# EAGLE design Solenoid_Driver (EAGLE 7.3.0)
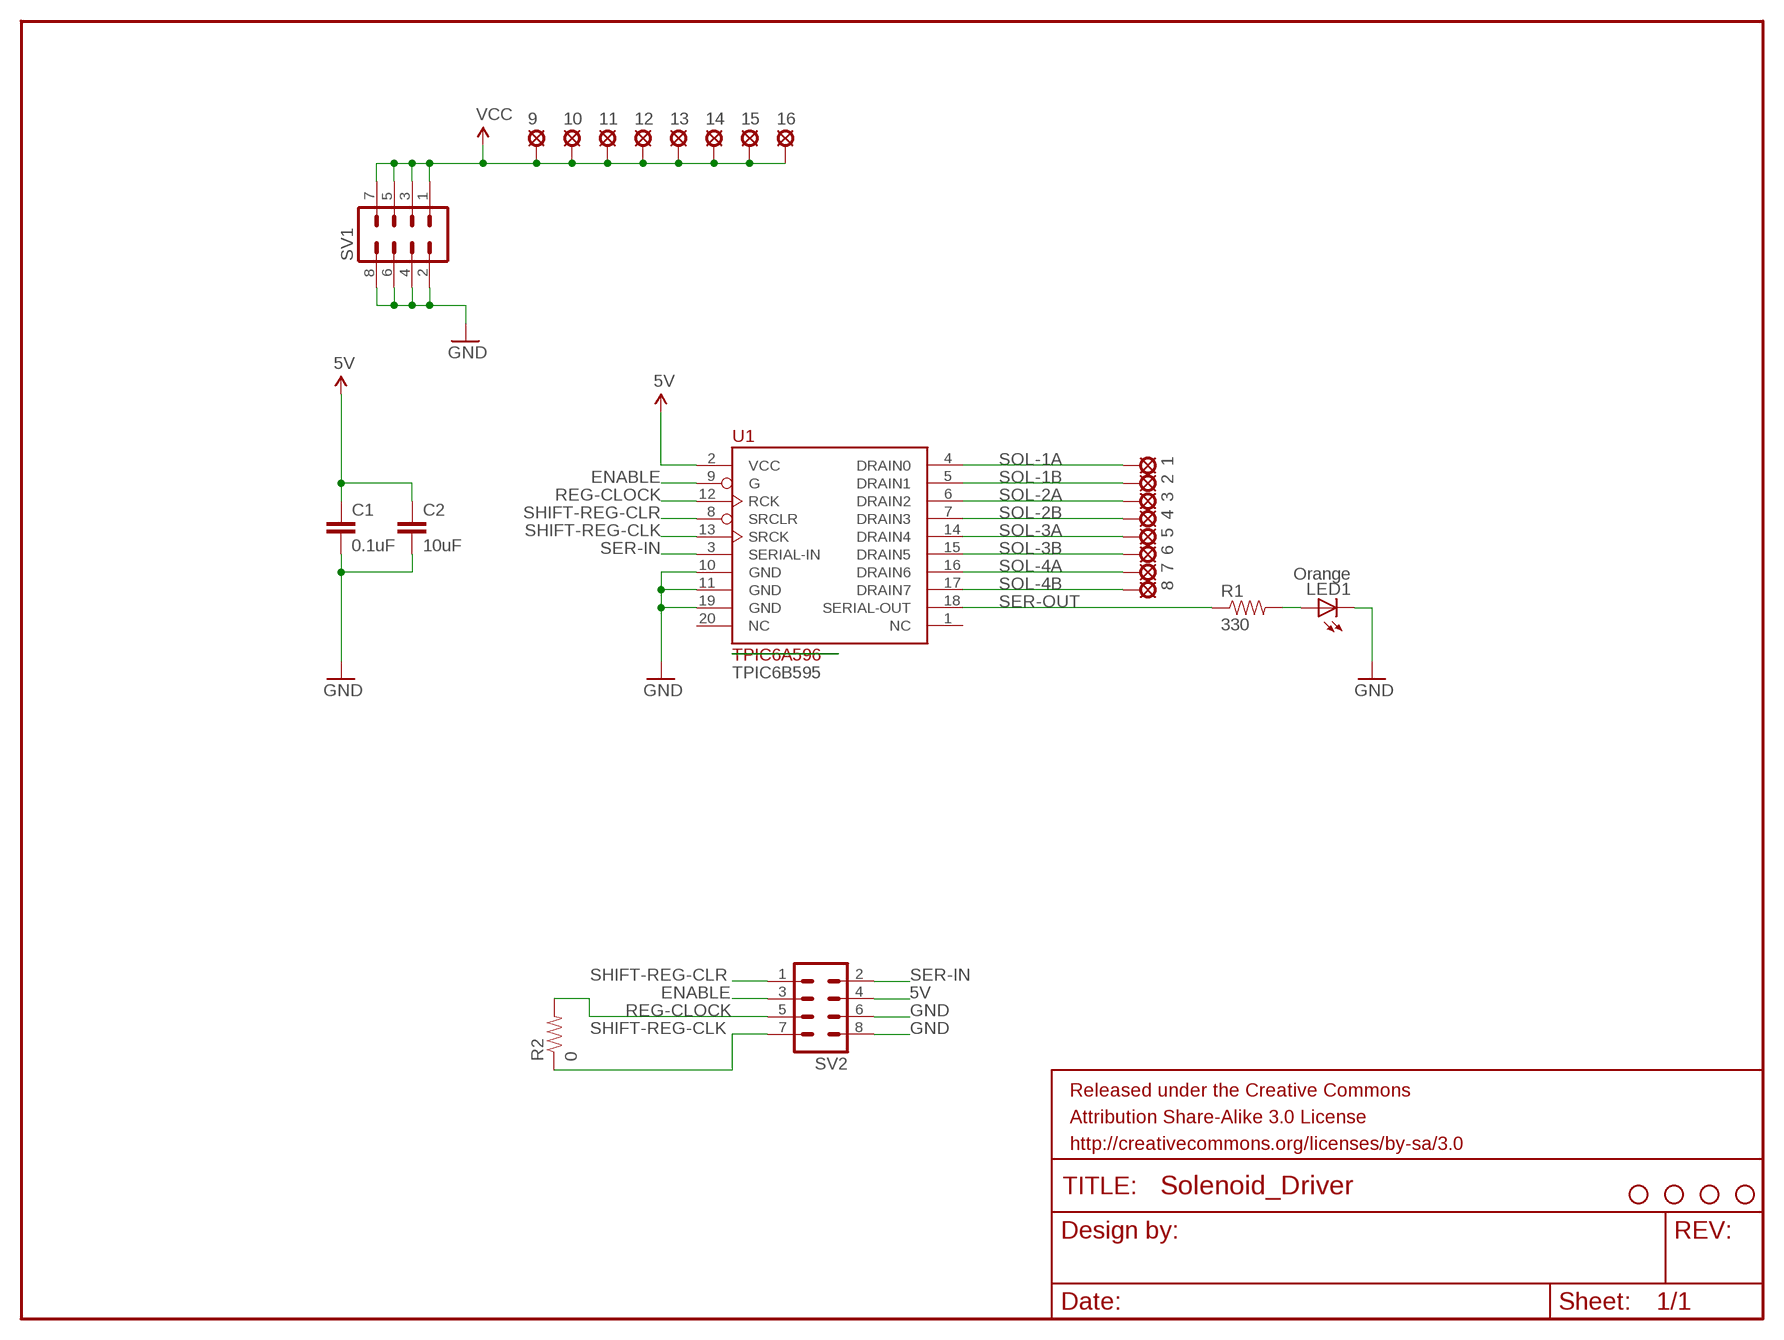
[diagram p0: schematic, sheet 1]

## Parts
1  SE14  [SE14]
2  SE14  [SE14]
3  SE14  [SE14]
4  SE14  [SE14]
5  SE14  [SE14]
6  SE14  [SE14]
7  SE14  [SE14]
8  SE14  [SE14]
9  SE14  [SE14]
10  SE14  [SE14]
11  SE14  [SE14]
12  SE14  [SE14]
13  SE14  [SE14]
14  SE14  [SE14]
15  SE14  [SE14]
16  SE14  [SE14]
C1  0.1uF  CAP0603-CAP  [0603-CAP]
C2  10uF  CAP0603-CAP  [0603-CAP]
JP1  STAND-OFF  [STAND-OFF]
JP2  STAND-OFF  [STAND-OFF]
JP3  STAND-OFF  [STAND-OFF]
JP4  STAND-OFF  [STAND-OFF]
LED1  Orange  LED0603  [LED-0603]
R1  330  RESISTOR0603-RES  [0603-RES]
R2  0  RESISTOR0603-RES  [0603-RES]
SV1  MA04-2  [MA04-2]
SV2  MA04-2  [MA04-2]
U1  TPIC6A596  [SOIC20-W]

## Nets
5V: C1.1 C2.1 SV2.4 U1.2(VCC)
ENABLE: SV2.3 U1.9(G)
GND: C1.2 C2.2 LED1.C SV1.2 SV1.4 SV1.6 SV1.8 SV2.6 SV2.8 U1.10(GND) U1.11(GND) U1.19(GND)
N$1: LED1.A R1.2
REG-CLOCK: R2.2 SV2.5 U1.12(RCK)
SER-IN: SV2.2 U1.3(SERIAL-IN)
SER-OUT: R1.1 U1.18(SERIAL-OUT)
SHIFT-REG-CLK: R2.1 SV2.7 U1.13(SRCK)
SHIFT-REG-CLR: SV2.1 U1.8(SRCLR)
SOL-1A: 1.MP U1.4(DRAIN0)
SOL-1B: 2.MP U1.5(DRAIN1)
SOL-2A: 3.MP U1.6(DRAIN2)
SOL-2B: 4.MP U1.7(DRAIN3)
SOL-3A: 5.MP U1.14(DRAIN4)
SOL-3B: 6.MP U1.15(DRAIN5)
SOL-4A: 7.MP U1.16(DRAIN6)
SOL-4B: 8.MP U1.17(DRAIN7)
VCC: 9.MP 10.MP 11.MP 12.MP 13.MP 14.MP 15.MP 16.MP SV1.1 SV1.3 SV1.5 SV1.7
Unconnected: U1.1(NC) U1.20(NC)

## Notes on the sheet
- TPIC6B595

## Library data of the parts
1-16 = solpad:SE14: SOLDER PAD E1553, drill 1,4mm, distributor Buerklin, 07F820
C1 C2 = SparkFun-Passives:CAP: Capacitor Standard 0603 ceramic capacitor, and 0.1" leaded capacitor.
JP1-JP4 = SparkFun-Electromechanical:STAND-OFF: #4 Stand Off This is the mechanical footprint for a #4 phillips button head screw. Use the keepout ring to avoid running the screw head into surrounding components. SKU : PRT-00447
LED1 = SparkFun-LED:LED: LEDs Standard schematic elements and footprints for 5mm, 3mm, 1206, and 0603 sized LEDs. 5mm - Spark Fun Electronics SKU : COM-00529 (and others)
R1 R2 = SparkFun-Passives:RESISTOR: Resistor Basic schematic elements and footprints for 0603, 1206, and PTH resistors.
SV1 SV2 = con-lstb:MA04-2: PIN HEADER; OC_FARNELL: unknown; OC_NEWARK: unknown
U1 = Personal:TPIC6A596

## Board
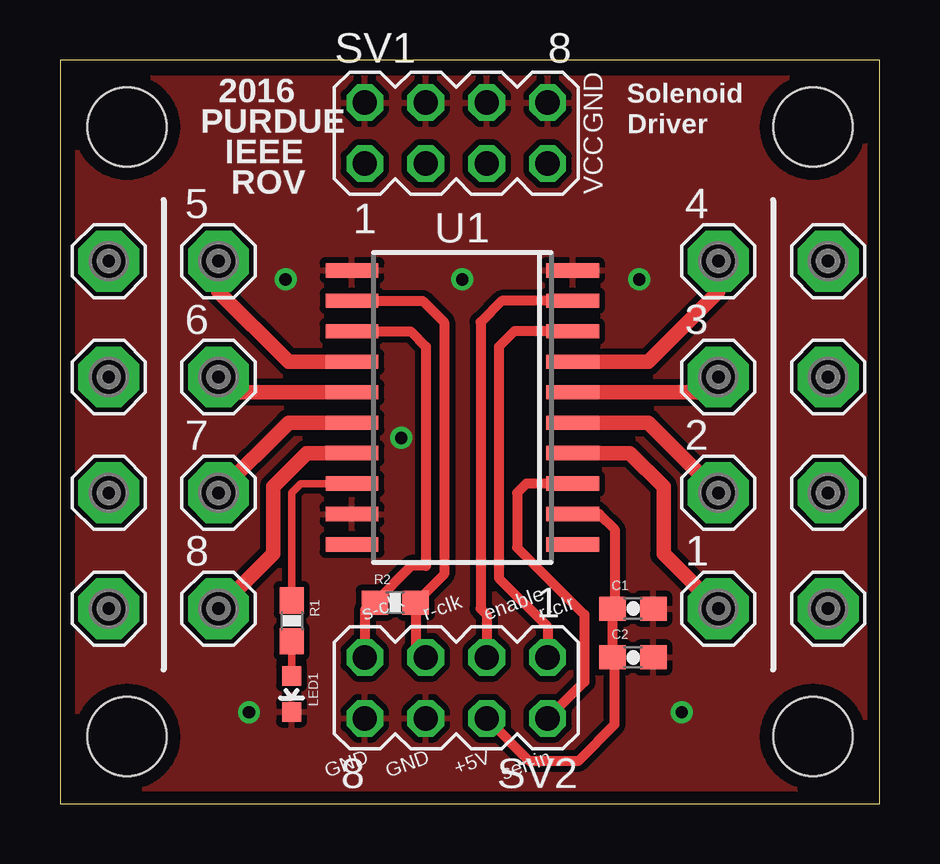
[diagram p1: board, top side]
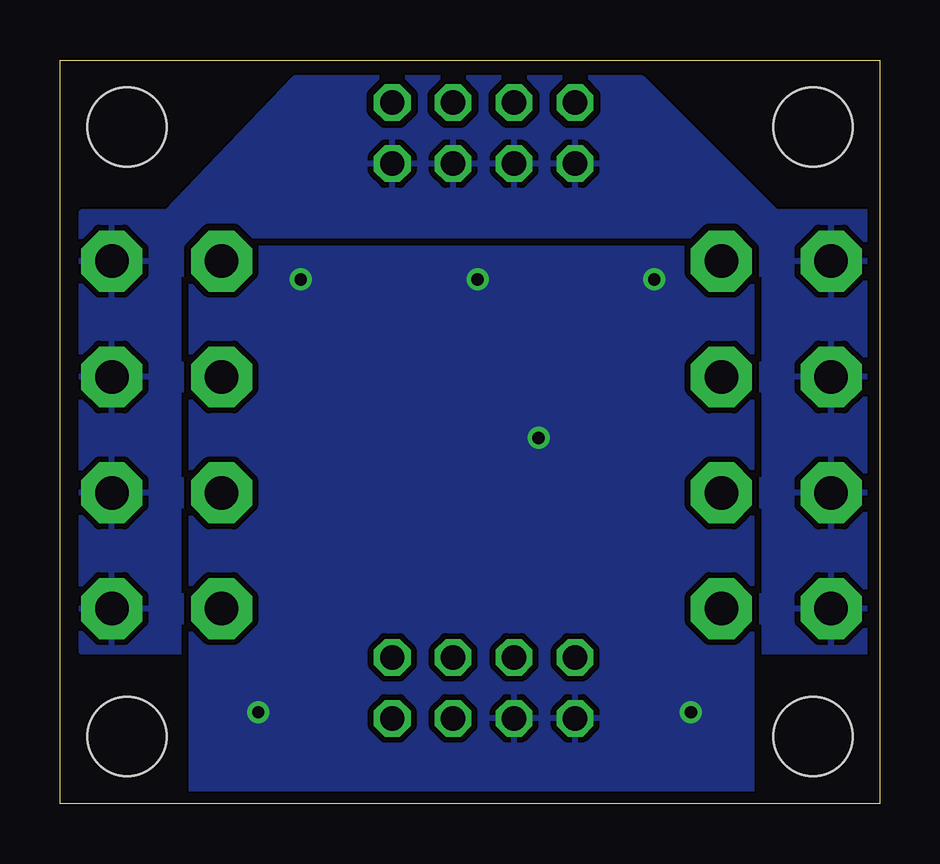
[diagram p2: board, bottom side, seen from below]

Size 34.16 x 30.99 mm. Coordinates in mm from the lower left corner, seen from the top.
Outline: 0,0 34.16,0 34.16,30.99 0,30.99 0,0
Copper layers (1*16): Top 0.0356mm / dielectric 1.5011mm / Bottom 0.0356mm
Design rules "default": minimum track width 7mil, minimum drill 14mil, track to track 7mil, track to pad 7mil, pad to pad 7mil, via to via 7mil, smd to smd 0mil, copper to edge 20mil, drill to drill 8mil, minimum pad ring 10mil, minimum via ring 8mil, stop-mask expansion 4mil, vias tented up to drill 25mil, thermal gap 10mil

### Footprints (pad centres in the part's own frame; a part is rotated, then mirrored left to right if it is on the bottom)
SE14 = drill 1.397 pad 2.54 octagon: MP 0,0
0603-CAP = smd 1.1 x 1: 1 -0.85,0; 2 0.85,0
STAND-OFF = hole 3.302: 0,0
LED-0603 = smd 0.8 x 0.8: A 0,-0.75; C 0,0.75
0603-RES = smd 1.1 x 1: 1 -0.85,0; 2 0.85,0
MA04-2 = drill 1.016 octagon: 1 -3.81,-1.27; 2 -3.81,1.27; 3 -1.27,-1.27; 4 -1.27,1.27; 5 1.27,-1.27; 6 1.27,1.27; 7 3.81,-1.27; 8 3.81,1.27
SOIC20-W = smd 0.6 x 2.2: 1 -5.715,-4.6; 2 -4.445,-4.6; 3 -3.175,-4.6; 4 -1.905,-4.6; 5 -0.635,-4.6; 6 0.635,-4.6; 7 1.905,-4.6; 8 3.175,-4.6; 9 4.445,-4.6; 10 5.715,-4.6; 11 5.715,4.6; 12 4.445,4.6; 13 3.175,4.6; 14 1.905,4.6; 15 0.635,4.6; 16 -0.635,4.6; 17 -1.905,4.6; 18 -3.175,4.6; 19 -4.445,4.6; 20 -5.715,4.6

### Placement (x,y rotation side)
1  27.43,8.13 0 top
2  27.43,12.95 0 top
3  27.43,17.78 0 top
4  27.43,22.61 0 top
5  6.6,22.61 0 top
6  6.6,17.78 0 top
7  6.6,12.95 0 top
8  6.6,8.13 0 top
9  2.03,22.61 0 top
10  2.03,17.78 0 top
11  2.03,12.95 0 top
12  2.03,8.13 0 top
13  32,8.13 0 top
14  32,12.95 0 top
15  32,17.78 0 top
16  32,22.61 0 top
C1  23.88,8.13 0 top
C2  23.88,6.1 0 top
JP1  2.79,2.79 0 top
JP2  31.37,2.79 0 top
JP3  2.79,28.19 0 top
JP4  31.37,28.19 0 top
LED1  9.65,4.57 180 top
R1  9.65,7.62 270 top
R2  13.97,8.38 0 top
SV1  16.51,27.94 0 top
SV2  16.51,4.83 180 top
U1  16.76,16.51 90 top

### Tracks (layer width: path | path; a pad name or v marks a point on that pad's centre or on a via)
5V
  Top 0.406: U1.2 22.48,12.06 23.11,11.43 23.11,8.22 C1.1 C2.1 23.11,6.01 23.11,3.3 21.59,1.78 19.56,1.78 SV2.4
ENABLE
  Top 0.406: U1.9 18.41,20.95 17.53,20.07 17.53,8.13 17.78,7.87 SV2.3
GND  (via drill 0.51)
  other vias: 16.76,21.84 7.87,3.81 25.91,3.81 24.13,21.84 9.4,21.84 14.22,15.24
  pour Top (isolate 0.254): 0.76,30.23 33.53,30.23 33.53,0.51 0.76,0.51
  pour Bottom (isolate 0.254): 5.33,23.11 28.7,23.11 28.7,0.51 5.33,0.51
N$1
  Top 0.305: LED1.A R1.2
REG-CLOCK
  Top 0.406: U1.12 15.11,20.95 16,20.07 16,9.56 R2.2 14.82,6.52 SV2.5
SER-IN
  Top 0.406: U1.3 19.43,13.34 19.05,12.95 19.05,10.67 21.84,7.87 21.84,5.08 SV2.2
SER-OUT
  Top 0.305: U1.18 10.03,13.34 9.65,12.95 R1.1
SHIFT-REG-CLK
  Top 0.406: U1.13 14.61,19.68 15.24,19.05 15.24,9.91 14.64,9.91 R2.1 arc90 12.7,7.96 SV2.7
SHIFT-REG-CLR
  Top 0.406: U1.8 18.92,19.68 18.29,19.05 18.29,9.4 20.32,7.37 SV2.1
SOL-1A
  Top 0.61: U1.4 23.75,14.61 25.15,13.21 25.15,10.41 1.MP
SOL-1B
  Top 0.61: U1.5 24.51,15.88 2.MP
SOL-2A
  Top 0.61: U1.6 26.8,17.14 3.MP
SOL-2B
  Top 0.61: U1.7 24.51,18.41 27.43,21.34 4.MP
SOL-3A
  Top 0.61: U1.14 9.53,18.41 6.6,21.34 5.MP
SOL-3B
  Top 0.61: U1.15 7.24,17.14 6.MP
SOL-4A
  Top 0.61: U1.16 9.53,15.88 7.MP
SOL-4B
  Top 0.61: U1.17 10.29,14.61 8.89,13.21 8.89,10.41 8.MP
VCC
  pour Bottom (isolate 0.305, rank 2): 0.51,6.35 0.51,24.64 4.32,24.64 9.91,30.23 24.38,30.23 29.72,24.64 33.27,24.64 33.27,6.35

### Text on the board
tPlace: 2016 | Solenoid | PURDUE | Driver | IEEE | ROV
_tsilk: GND | VCC | s-clk | r-clk | enable | r-clr | GND | GND | +5V | ser-in